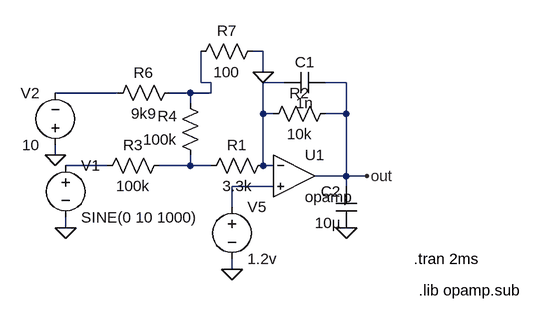
[diagram p0: schematic inputAttenuverterSchematic.asc]
inputAttenuverterSchematic.asc, the LTspice schematic file:
Version 4
SHEET 1 880 688
WIRE 432 128 416 128
WIRE 432 160 432 128
WIRE 336 176 336 128
WIRE 352 176 336 176
WIRE 464 176 432 176
WIRE 560 176 528 176
WIRE 208 192 112 192
WIRE 320 192 288 192
WIRE 352 192 352 176
WIRE 352 192 320 192
WIRE 320 208 320 192
WIRE 432 224 432 176
WIRE 448 224 432 224
WIRE 560 224 560 176
WIRE 560 224 528 224
WIRE 112 288 112 272
WIRE 192 304 128 304
WIRE 320 304 320 288
WIRE 320 304 272 304
WIRE 352 304 320 304
WIRE 432 304 432 224
WIRE 448 304 432 304
WIRE 560 320 560 224
WIRE 560 320 512 320
WIRE 592 320 560 320
WIRE 448 336 384 336
WIRE 560 336 560 320
WIRE 384 368 384 336
WIRE 128 400 128 384
WIRE 384 464 384 448
FLAG 128 400 0
FLAG 384 464 0
FLAG 112 288 0
FLAG 432 160 0
FLAG 592 320 out
FLAG 560 400 0
SYMBOL voltage 128 288 R0
SYMATTR InstName V1
SYMATTR Value SINE(0 10 1000)
SYMBOL voltage 384 352 R0
SYMATTR InstName V5
SYMATTR Value 1.2v
SYMBOL res 448 288 R90
WINDOW 0 0 56 VBottom 2
WINDOW 3 32 56 VTop 2
SYMATTR InstName R1
SYMATTR Value 3.3k
SYMBOL res 544 208 R90
WINDOW 0 0 56 VBottom 2
WINDOW 3 32 56 VTop 2
SYMATTR InstName R2
SYMATTR Value 10k
SYMBOL res 288 288 R90
WINDOW 0 0 56 VBottom 2
WINDOW 3 32 56 VTop 2
SYMATTR InstName R3
SYMATTR Value 100k
SYMBOL res 336 304 R180
WINDOW 0 36 76 Left 2
WINDOW 3 36 40 Left 2
SYMATTR InstName R4
SYMATTR Value 100k
SYMBOL res 304 176 R90
WINDOW 0 0 56 VBottom 2
WINDOW 3 32 56 VTop 2
SYMATTR InstName R6
SYMATTR Value 9k9
SYMBOL res 320 144 R270
WINDOW 0 32 56 VTop 2
WINDOW 3 0 56 VBottom 2
SYMATTR InstName R7
SYMATTR Value 100
SYMBOL voltage 112 288 R180
WINDOW 0 24 96 Left 2
WINDOW 3 24 16 Left 2
SYMATTR InstName V2
SYMATTR Value 10
SYMBOL Opamps/opamp 480 256 R0
SYMATTR InstName U1
SYMBOL cap 528 160 R90
WINDOW 0 0 32 VBottom 2
WINDOW 3 32 32 VTop 2
SYMATTR InstName C1
SYMATTR Value 1n
SYMBOL cap 576 400 R180
WINDOW 0 24 56 Left 2
WINDOW 3 24 8 Left 2
SYMATTR InstName C2
SYMATTR Value 10µ
TEXT 664 448 Left 2 !.tran 2ms
TEXT 672 496 Left 2 !.lib opamp.sub

The netlist it stands for:
* inputAttenuverterSchematic.asc
V1 N004 0 SINE(0 10 1000)
V5 N006 0 1.2v
R1 N002 N005 3.3k
R2 out N002 10k
R3 N005 N004 100k
R4 N005 N001 100k
R6 N001 N003 9k9
R7 N001 0 100
V2 0 N003 10
XU1 N002 N006 out opamp Aol=100K GBW=10Meg  ; pins invin noninvin out
C1 out N002 1n
C2 0 out 10µ
.tran 2ms
.lib opamp.sub
.backanno
.end